# Altium schematic sheet STM32F103-Breakout-Board.SchDoc
size A3; SheetNumber: 1; SheetTotal: 1
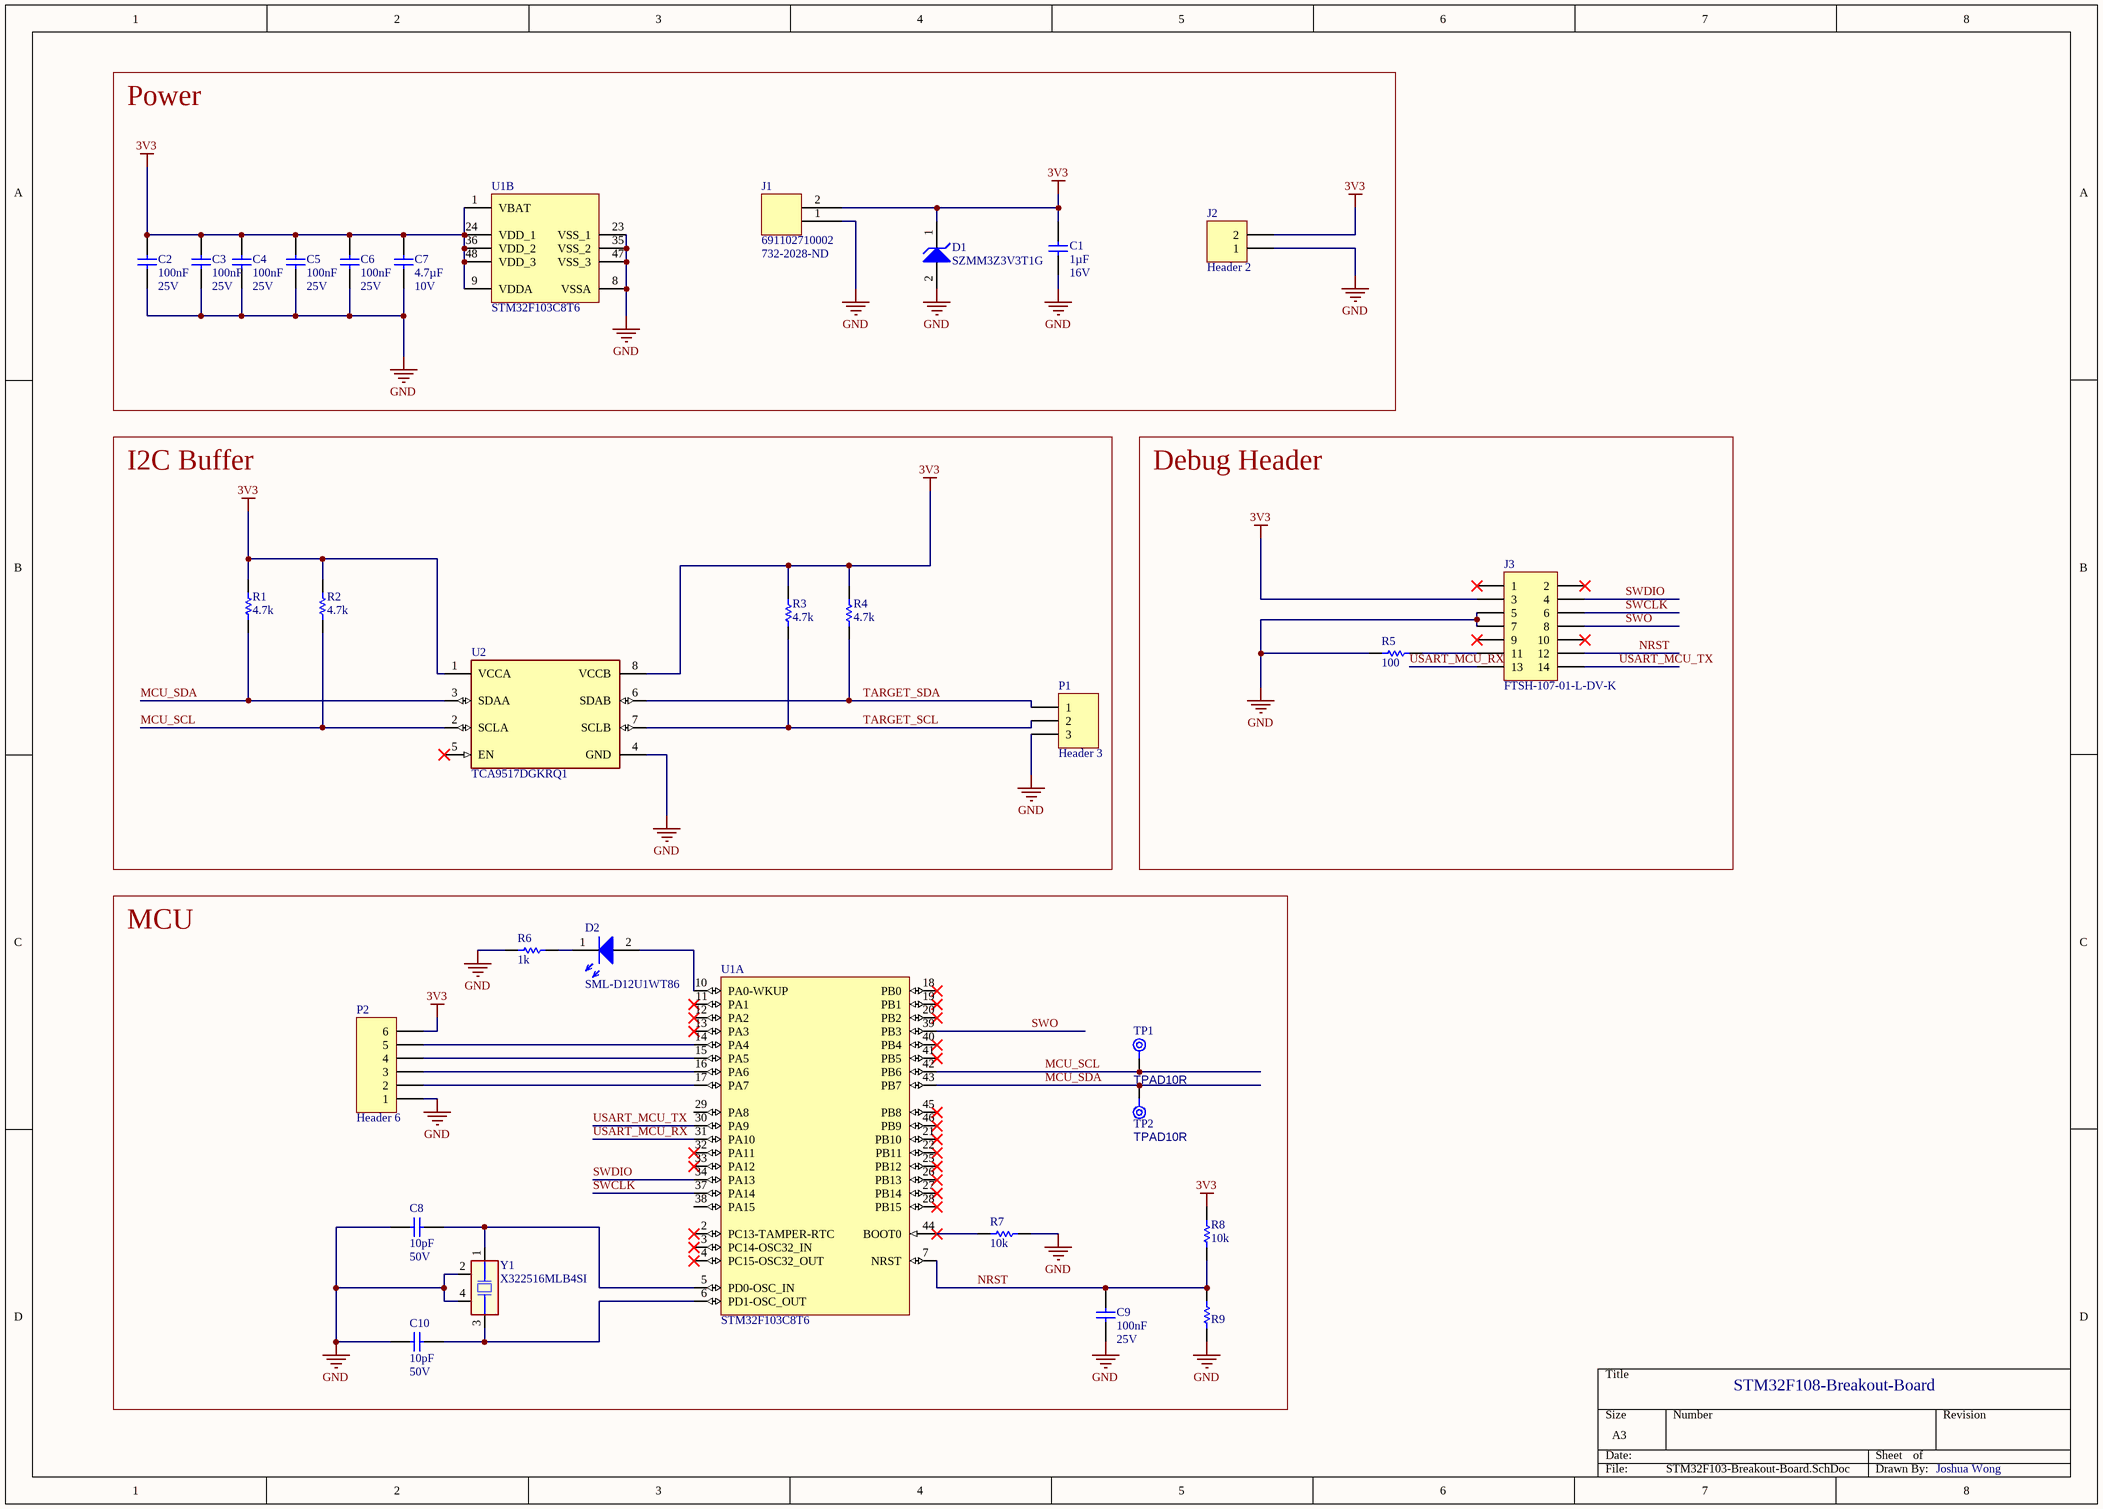
[diagram p0: STM32F103-Breakout-Board.SchDoc]

## Parts
C1  value 1µF  Voltage Rating: 16V  [CAP0603R]  (hidden comment: GCM188R71C105KA64J)
C2  value 100nF  Voltage Rating: 25V  [CAP0603R]  (hidden comment: TMK107B7104KAHT)
C3  value 100nF  Voltage Rating: 25V  [CAP0603R]  (hidden comment: TMK107B7104KAHT)
C4  value 100nF  Voltage Rating: 25V  [CAP0603R]  (hidden comment: TMK107B7104KAHT)
C5  value 100nF  Voltage Rating: 25V  [CAP0603R]  (hidden comment: TMK107B7104KAHT)
C6  value 100nF  Voltage Rating: 25V  [CAP0603R]  (hidden comment: TMK107B7104KAHT)
C7  value 4.7µF  Voltage Rating: 10V  [CAPC0603(1608)100_L]  (hidden comment: Capacitor 4.7µF +/-20% 10V 0603)
C8  value 10pF  Voltage Rating: 50V  [CAP0402R]  (hidden comment: GJM1555C1H100JB01D)
C9  value 100nF  Voltage Rating: 25V  [CAP0603R]  (hidden comment: TMK107B7104KAHT)
C10  value 10pF  Voltage Rating: 50V  [CAP0402R]  (hidden comment: GJM1555C1H100JB01D)
D1  SZMM3Z3V3T1G  [ONSC-SOD-323-2-477-02_V]
D2  SML-D12U1WT86  [LED0603]
J1  691102710002  Supplier Part Number 1: 732-2028-ND  [CON2_SCREW_5.00MM_691102710002]
J2  Header 2  [HDR1X2]
J3  FTSH-107-01-L-DV-K  [FP-FTSH-107-01-L-DV-K-MFG]
P1  Header 3  [HDR1X3]
P2  Header 6  [HDR1X6]
R1  value 4.7k  [RES0603R]  (hidden comment: CRCW06034K70FKEA)
R2  value 4.7k  [RES0603R]  (hidden comment: CRCW06034K70FKEA)
R3  value 4.7k  [RES0603R]  (hidden comment: CRCW06034K70FKEA)
R4  value 4.7k  [RES0603R]  (hidden comment: CRCW06034K70FKEA)
R5  value 100  [RES0603R]  (hidden comment: ERJ-3GEYJ101V)
R6  value 1k  [RES0603R]  (hidden comment: CRCW06031K00FKTA)
R7  value 10k  [RES0603R]  (hidden comment: ERA-3AEB103V)
R8  value 10k  [RES0603R]  (hidden comment: ERA-3AEB103V)
R9  Resistor 0R 0402 63 mW  [RESC1005X40X25ML05T10]  (value not drawn)
TP1  TPAD10R  [TP10R]  (no BOM)
TP2  TPAD10R  [TP10R]  (no BOM)
U1  STM32F103C8T6  [STM-LQFP48_M]  (parts A,B of 2)
U2  TCA9517DGKRQ1  [FP-DGK0008A-MFG]
Y1  X322516MLB4SI  [X322516MLB4SI-Footprint-1]

## Blocks framed on the sheet
Power: C1-C7 D1 J1 J2 U1
I2C Buffer: P1 R1-R4 U2
Debug Header: J3 R5
MCU: C8-C10 D2 P2 R6-R9 TP1 TP2 U1 Y1

## Nets
3V3: C1.2 C2.2 C3.2 C4.2 C5.2 C6.2 C7.2 D1.1(K) J1.2 J2.2 J3.3 P2.6 R1.2 R2.2 R3.2 R4.2 R8.2 U1.1(VBAT) U1.9(VDDA) U1.24(VDD_1) U1.36(VDD_2) U1.48(VDD_3) U2.1(VCCA) U2.8(VCCB)
GND: C1.1 C2.1 C3.1 C4.1 C5.1 C6.1 C7.1 C8.2 C9.1 C10.2 D1.2(A) J1.1 J2.1 J3.5 J3.7 P1.3 P2.1 R5.1 R6.1 R7.1 R9.1 U1.8(VSSA) U1.23(VSS_1) U1.35(VSS_2) U1.47(VSS_3) U2.4(GND) Y1.2(GND) Y1.4(GND)
MCU_SCL: R2.1 TP1.1(TP) U1.42(PB6) U2.2(SCLA)
MCU_SDA: R1.1 TP2.1(TP) U1.43(PB7) U2.3(SDAA)
NRST: C9.2 J3.12 R8.1 R9.2 U1.7(NRST)
SWCLK: J3.6 U1.37(PA14)
SWDIO: J3.4 U1.34(PA13)
SWO: J3.8 U1.39(PB3)
TARGET_SCL: P1.2 R3.1 U2.7(SCLB)
TARGET_SDA: P1.1 R4.1 U2.6(SDAB)
USART_MCU_RX: J3.13 U1.31(PA10)
USART_MCU_TX: J3.14 U1.30(PA9)
NetC8_1: C8.1 U1.5(PD0-OSC_IN) Y1.1(OSC1)
NetC10_1: C10.1 U1.6(PD1-OSC_OUT) Y1.3(OSC2)
NetD2_1: D2.1(Cathode) R6.2
NetD2_2: D2.2(Anode) U1.10(PA0-WKUP)
NetJ3_11: J3.11 R5.2
NetP2_2: P2.2 U1.17(PA7)
NetP2_3: P2.3 U1.16(PA6)
NetP2_4: P2.4 U1.15(PA5)
NetP2_5: P2.5 U1.14(PA4)
NetR7_2: R7.2 U1.44(BOOT0)

Not connected (* = marked no-connect by the designer): J3 1* 2* 9* 10*; U1 2(PC13-TAMPER-RTC)* 3(PC14-OSC32_IN)* 4(PC15-OSC32_OUT)* 11(PA1)* 12(PA2)* 13(PA3)* 18(PB0)* 19(PB1)* 20(PB2)* 21(PB10)* 22(PB11)* 25(PB12)* 26(PB13)* 27(PB14)* 28(PB15)* 29(PA8) 32(PA11)* 33(PA12)* 38(PA15) 40(PB4)* 41(PB5)* 45(PB8)* 46(PB9)*; U2 5(EN)*

## Notes on the sheet
- STM32F108-Breakout-Board
- Joshua Wong

## Library data of the parts
C1 = CMP-024-000687-8: CAP CER 1UF 16V X7R 0603; Manufacturer: Murata Electronics; Tolerance: 10%; Max Operating Temperature: 125°C; Supplier Part Number 1: 490-12657-1-ND; PN: GCM188R71C105KA64J; Case/Package: 0603 (1608 Metric); ComponentLink1Description: Datasheet; Supplier 1: Digi-Key; Min Operating Temperature: -55°C; ComponentLink1URL: https://www.murata.com/~/media/webrenewal/support/library/catalog/products/capacitor/mlcc/c03e.ashx?la=en-us; Temperature Coefficient: X7R; Rating: AEC-Q200
C2-C6 C9 = CMP-024-001300-8: CAP CER 0.1UF 25V X7R 0603; Manufacturer: Taiyo Yuden; Tolerance: 10%; ComponentLink1URL: https://www.yuden.co.jp/productdata/catalog/mlcc_all_hq_e.pdf; Max Operating Temperature: 125°C; Case/Package: 0603 (1608 Metric); Min Operating Temperature: -55°C; Supplier Part Number 1: 587-3468-1-ND; ComponentLink1Description: Datasheet; PN: TMK107B7104KAHT; Temperature Coefficient: X7R; Rating: AEC-Q200; Supplier 1: Digi-Key
C7 = CMP-001-00076-9: Chip Capacitor, 4.7µF +/-20%, 10V, 0603, Thickness 1 mm; Tolerance: 10%; Case/Package: 0603 (1608 Metric); Max Operating Temperature: 85°C; Min Operating Temperature: -55°C
C8 C10 = CMP-024-000904-8: CAP CER 10PF 50V C0G/NP0 0402; Manufacturer: Murata Electronics; Temperature Coefficient: C0G, NP0; Tolerance: 5%; Max Operating Temperature: 125°C; Supplier Part Number 1: 490-3113-1-ND; ComponentLink1Description: Datasheet; Supplier 1: Digi-Key; PN: GJM1555C1H100JB01D; Case/Package: 0402 (1005 Metric); Rating: -; ComponentLink1URL: https://search.murata.co.jp/Ceramy/image/img/A01X/G101/ENG/GJM1555C1H100JB01-01.pdf; Min Operating Temperature: -55°C
D1 = CMP-004-00015-1: Zener Diode, 3.3V V(Z), 6%, 0.3W, Silicon, Unidirectional; Max Operating Temperature: 150°C; RoHS Compliant: Yes
D2 = CMP-029-000028-3: LED RED DIFFUSED 1608 SMD; Manufacturer: Rohm Semiconductor; Voltage - Forward Max: 2.2V; Current - Average: 20mA; ComponentLink1URL: https://d1d2qsbl8m0m72.cloudfront.net/en/products/databook/datasheet/opto/led/chip_mono/sml-d12x1-e.pdf; Package: 0603 (1608 Metric); Supplier 1: Digi-Key; Type: LED; PN: SML-D12U1WT86; Color: Red; ComponentLink1Description: Datasheet; Supplier Part Number 1: SML-D12U1WT86CT-ND
J1 = CMP-027-000000-1: 2 Position Wire to Board Terminal Block Horizontal with Board 0.197" (5.00mm) Through Hole; Manufacturer: Würth Elektronik; Connector Type: Screw Terminal; Number of Positions: 2; Pitch - Mating: 0.197" (5.00mm); ComponentLink1URL: https://www.we-online.de/katalog/datasheet/6911027100xx.pdf; ComponentLink1Description: Datasheet; Supplier 1: Digi-Key; Series: WR-TBL Series 102; PN: 691102710002; Number of Rows: 1; Contact Type: Wire
J2 = CMP-083-000070-4: Header, 2-Pin; Signal Integrity: Connector; Source: Miscellaneous Connectors.SchLib; LatestRevisionDate: 17-Jul-2002; Pin Count: 2; Design Item ID: Header 2; LatestRevisionNote: Re-released for DXP Platform.; Component Type: Standard; Publisher: Altium Limited
J3 = CMP-002-00034-3: Conn Unshrouded Header HDR 14 POS 1.27mm Solder ST Top Entry SMD TIGER CLAW™ Tube; Current Rating: 3.4A; Number of Contacts: 14; Gender: Male; Pitch: 1.27mm; Number of Rows: 2; Min Operating Temperature: -55°C; Contact Material: Bronze; Max Operating Temperature: 125°C
P1 = CMP-083-000090-3: Header, 3-Pin; Signal Integrity: Connector; LatestRevisionNote: Re-released for DXP Platform.; Source: Miscellaneous Connectors.SchLib; Design Item ID: Header 3; LatestRevisionDate: 17-Jul-2002; Publisher: Altium Limited; Component Type: Standard; Pin Count: 3
P2 = CMP-083-000107-2: Header, 6-Pin; Signal Integrity: Connector; LatestRevisionNote: Re-released for DXP Platform.; Design Item ID: Header 6; Source: Miscellaneous Connectors.SchLib; Pin Count: 6; LatestRevisionDate: 17-Jul-2002; Component Type: Standard; Publisher: Altium Limited
R1-R4 = CMP-054-001314-6: RES SMD 4.7K OHM 1% 1/10W 0603; Manufacturer: Vishay Dale; Power: 100mW; Tolerance: 1%; Rating: AEC-Q200; Supplier Part Number 1: 541-4.70KHCT-ND; Composition: Thick Film; Supplier 1: Digi-Key; Min Operating Temperature: -55°C; Case/Package: 0603 (1608 Metric); ComponentLink1Description: Datasheet; ComponentLink1URL: https://www.vishay.com/docs/20035/dcrcwe3.pdf; Max Operating Temperature: 155°C; PN: CRCW06034K70FKEA
R5 = CMP-054-002817-6: RES SMD 100 OHM 5% 1/10W 0603; Manufacturer: Panasonic; Power: 100mW; Min Operating Temperature: -55°C; Max Operating Temperature: 155°C; Rating: AEC-Q200; PN: ERJ-3GEYJ101V; ComponentLink1Description: Datasheet; Tolerance: 5%; Supplier Part Number 1: P100GCT-ND; Supplier 1: Digi-Key; Case/Package: 0603 (1608 Metric); ComponentLink1URL: http://industrial.panasonic.com/www-cgi/jvcr13pz.cgi?E+PZ+3+AOA0001+ERJ3GEYJ101V+7+WW; Composition: Thick Film
R6 = CMP-054-000907-6: RES SMD 1K OHM 1% 1/10W 0603; Manufacturer: Vishay Dale; Power: 100mW; Supplier 1: Digi-Key; Supplier Part Number 1: 541-2987-1-ND; PN: CRCW06031K00FKTA; ComponentLink1URL: https://www.vishay.com/docs/20008/dcrcw.pdf; Rating: AEC-Q200; Composition: Thick Film; ComponentLink1Description: Datasheet; Case/Package: 0603 (1608 Metric); Tolerance: 1%; Max Operating Temperature: 155°C; Min Operating Temperature: -55°C
R7 R8 = CMP-054-002375-6: RES SMD 10K OHM 0.1% 1/10W 0603; Manufacturer: Panasonic; Power: 100mW; Max Operating Temperature: 155°C; Tolerance: 0.1%; ComponentLink1Description: Datasheet; Min Operating Temperature: -55°C; Composition: Thin Film; Case/Package: 0603 (1608 Metric); Supplier Part Number 1: P10KDBCT-ND; PN: ERA-3AEB103V; Rating: AEC-Q200; ComponentLink1URL: https://industrial.panasonic.com/cdbs/www-data/pdf/RDM0000/AOA0000C307.pdf; Supplier 1: Digi-Key
R9 = CMP-009-00004-5: Chip Resistor, 0 Ohm, 0.063 W, -55 to 155 degC, 0402 (1005 Metric); Value: 0; Power: 63mW; Voltage Rating: 50V; Max Operating Temperature: 155°C; Pins: 2; RoHS Compliant: True; Min Operating Temperature: -55°C; Mounting Technology: SM; Case/Package: 0402
TP1 TP2 = CMP-00028-00000-4: 1mm round; Pins: 1
U1 = CMP-00007-1: RISC Microcontroller, 32-Bit, FLASH, STM32 CPU, 72MHz, CMOS, PQFP48; Number of I/O Lines: 37; Qualification Status: Not Qualified; Interface: I2C,SPI,USB,CAN,USART; Peripherals: POR,DMA; Package Equivalence Code: QFP48,.35SQ,20; Max Supply Voltage: 3.6V; Min Supply Voltage: 2V; Package Body Material: Plastic; Time @ Peak Reflow Temperature-Max (s): 30s; Max Supply Current: 50mA; Power Supplies: 2.5/3.3; Clock Frequency: 16MHz; Nominal Supply Voltage: 3.3V; JESD-609 Code: e4; Peak Reflow Temperature (Cel): 260°C; Package Shape: Square; Width: 7mm; Moisture Sensitivity Level: 2; Terminal Form: Gull Wing; Technology: CMOS; Terminal Position: QUAD; Terminal Finish: Nickel; Max Operating Temperature: 105°C; RoHS Compliant: Yes; Pins: 48; Length: 7mm; Temperature Grade: INDUSTRIAL; Surface Mount: Yes; Case/Package: LFQFP; Reach SVHC Compliant: Yes; Terminal Pitch: 0.5mm; JESD-30 Code: S-PQFP-G48; Min Operating Temperature: -40°C; Height - Seated (Max): 1.6mm
U2 = CMP-015-00008-5: Voltage Level Translator Bidirectional 1 Circuit 2 Channel 8-VSSOP; Frequency: 400kHz; Max Operating Temperature: 125°C; Case/Package: VSSOP; Min Operating Temperature: -40°C; Channel Type: Bidirectional
Y1 = CMP-003-00003-2: 16MHz Surface Mount Crystal 9pF ±10ppm ±20ppm SMD3225-4P Crystals ROHS; Frequency: 16MHz